# EAGLE design mcu_v2 (EAGLE 6.5.0)
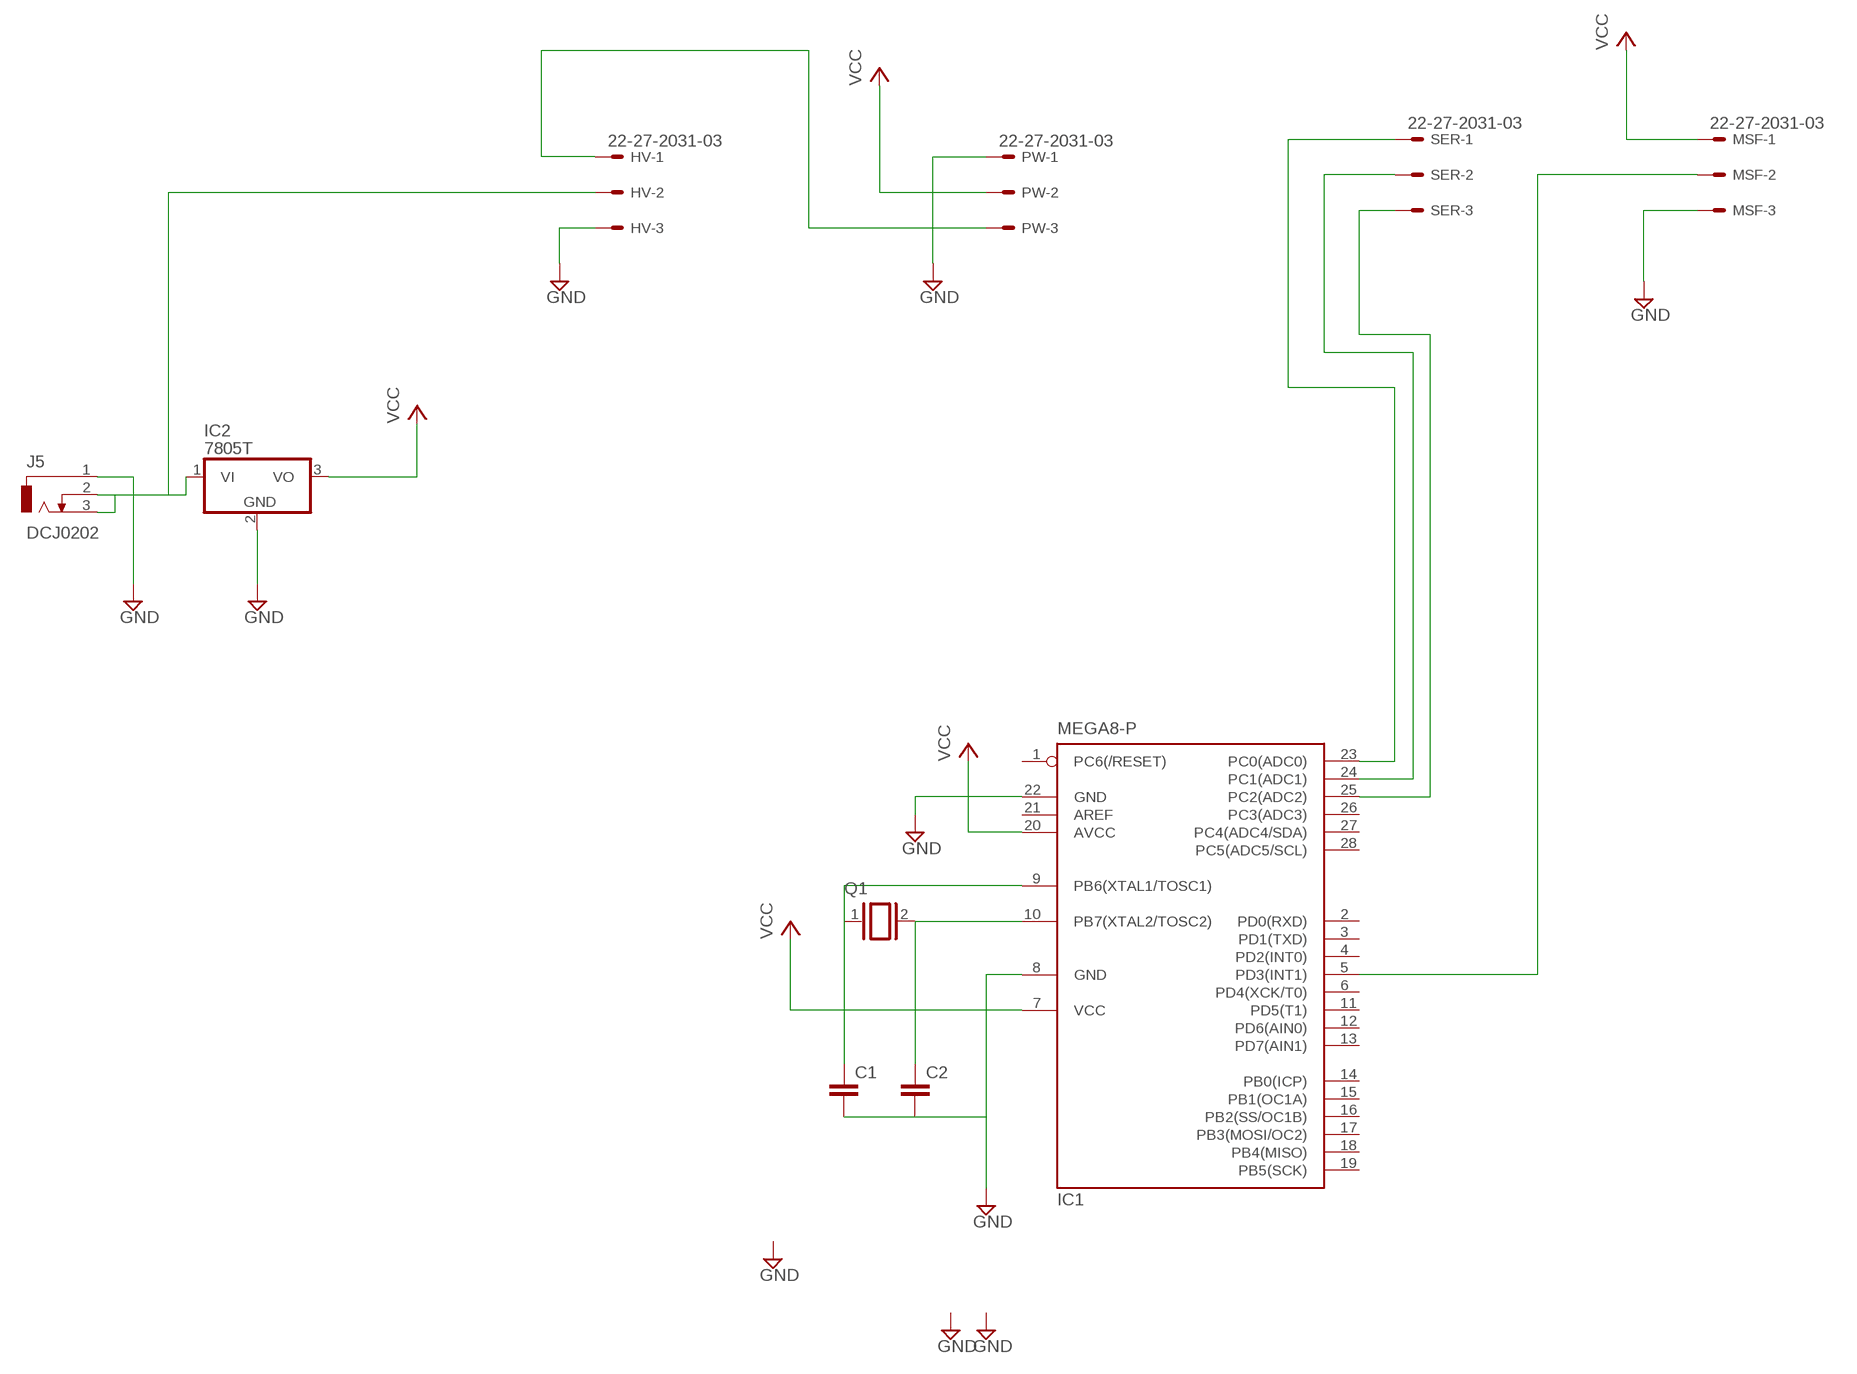
[diagram p0: schematic, sheet 1]

## Parts
C1  C2,5-3  [C2.5-3]
C2  C2,5-3  [C2.5-3]
HV  22-27-2031-03  [6410-03]
IC1  MEGA8-P  [DIL28-3]
IC2  7805T  [TO220H]
J5  DCJ0202  [DCJ0202]
MSF  22-27-2031-03  [6410-03]
PW  22-27-2031-03  [6410-03]
Q1  XTAL/S  [QS]
SER  22-27-2031-03  [6410-03]

## Nets
GND: C1.2 C2.2 HV.3 IC1.8(GND) IC1.22(GND) IC2.2(GND) J5.1 MSF.3 PW.1
N$1: HV.2 IC2.1(VI) J5.2 J5.3
N$2: HV.1 PW.3
N$3: C2.1 IC1.10(PB7(XTAL2/TOSC2)) Q1.2
N$4: C1.1 IC1.9(PB6(XTAL1/TOSC1)) Q1.1
N$6: IC1.5(PD3(INT1)) MSF.2
N$7: IC1.23(PC0(ADC0)) SER.1
N$8: IC1.24(PC1(ADC1)) SER.2
N$9: IC1.25(PC2(ADC2)) SER.3
VCC: IC1.7(VCC) IC1.20(AVCC) IC2.3(VO) MSF.1 PW.2
Unconnected: IC1.1(PC6(/RESET)) IC1.2(PD0(RXD)) IC1.3(PD1(TXD)) IC1.4(PD2(INT0)) IC1.6(PD4(XCK/T0)) IC1.11(PD5(T1)) IC1.12(PD6(AIN0)) IC1.13(PD7(AIN1)) IC1.14(PB0(ICP)) IC1.15(PB1(OC1A)) IC1.16(PB2(SS/OC1B)) IC1.17(PB3(MOSI/OC2)) IC1.18(PB4(MISO)) IC1.19(PB5(SCK)) IC1.21(AREF) IC1.26(PC3(ADC3)) IC1.27(PC4(ADC4/SDA)) IC1.28(PC5(ADC5/SCL))

## Library data of the parts
C1 C2 = capacitor-wima:C: CAPACITOR naming: grid - package width
HV MSF PW SER = con-molex:22-?-03: CONNECTOR wire to board 2.54 mm (.1 inch) pitch header; OC_FARNELL: unknown; OC_NEWARK: unknown
IC1 = atmel:MEGA8-P: MICROCONTROLLER 8 Kbytes FLASH, 1 kbytes SRAM, 512 bytes EEPROM, USART, 4-channel 10 bit ADC, 2-channel 8 bit ADC Pin compatible with Atmega48, ATMega88, ATMega168 Source: avr.lbr; OC_FARNELL: unknown; OC_NEWARK: unknown
IC2 = linear:78*: Positive VOLTAGE REGULATOR Source: http://cache.national.com/ds/LM/LM78L05.pdf http://www.fairchildsemi.com/ds/LM/LM7805.pdf
J5 = con-jack:DCJ0202: DC POWER JACK Source: DCJ0202.pdf; OC_FARNELL: unknown; OC_NEWARK: unknown
Q1 = special:XTAL/S: CRYSTAL

## Board
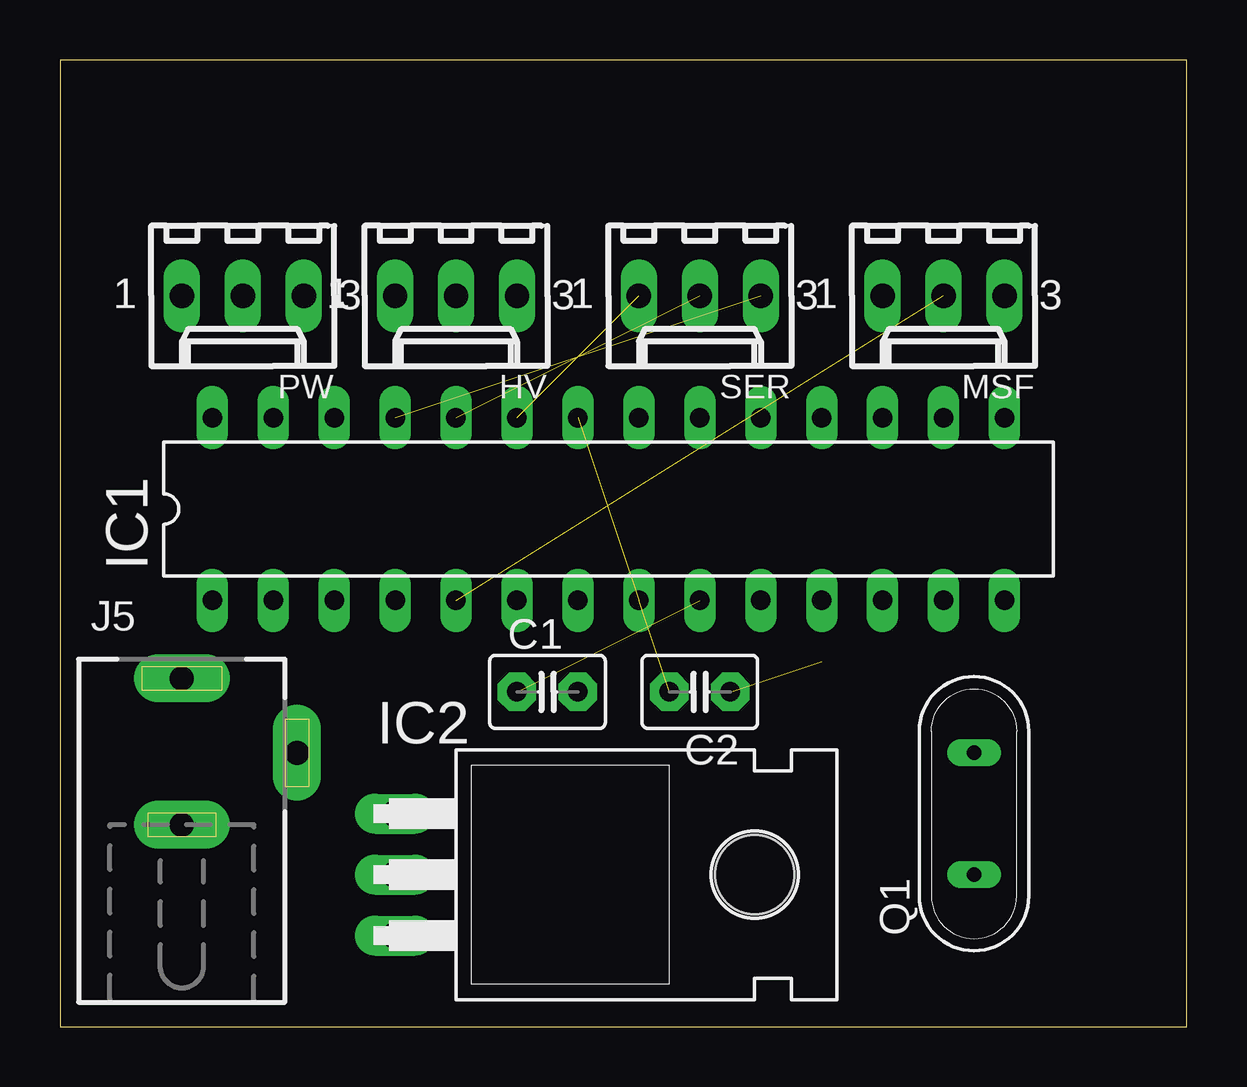
[diagram p1: board, top side]
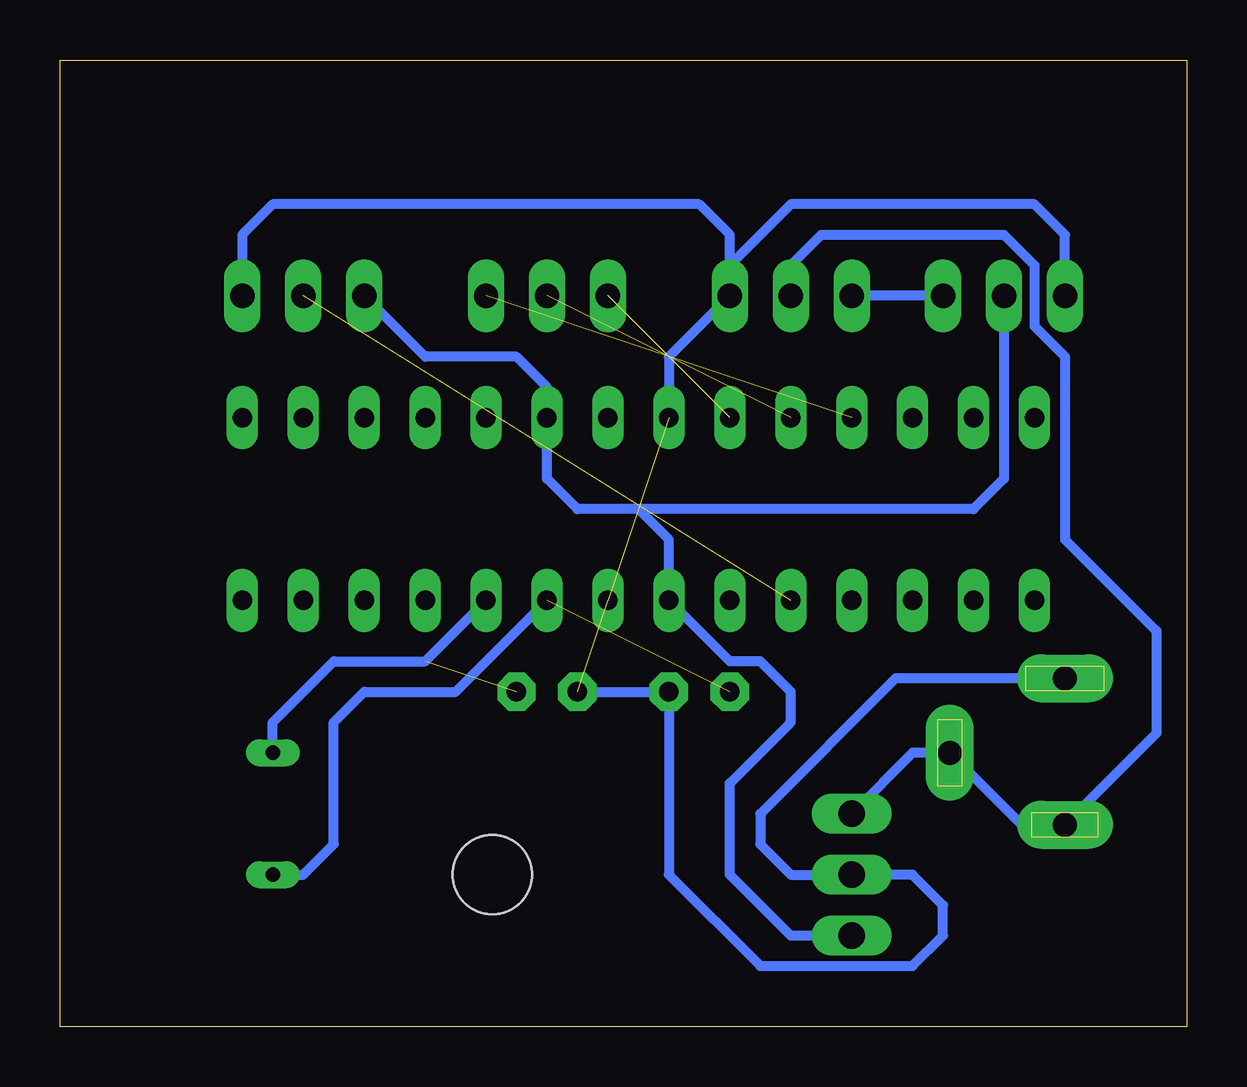
[diagram p2: board, bottom side, seen from below]

Size 46.97 x 40.31 mm. Coordinates in mm from the lower left corner, seen from the top.
Outline: 0,0 46.97,0 46.97,40.31 0,40.31 0,0
Copper layers (1*16): Top 0.035mm / dielectric 1.5mm / Bottom 0.035mm
Design rules "default": minimum track width 10mil, minimum drill 24mil, track to track 8mil, track to pad 8mil, pad to pad 8mil, via to via 8mil, smd to smd 8mil, copper to edge 40mil, drill to drill 8mil, minimum pad ring 10mil, minimum via ring 8mil, stop-mask expansion 4mil, vias tented up to drill 0mil, thermal gap 10mil

### Footprints (pad centres in the part's own frame; a part is rotated, then mirrored left to right if it is on the bottom)
C2.5-3 = drill 0.813 pad 1.6 octagon: 1 -1.27,0; 2 1.27,0
6410-03 = drill 1.016 long: 1 2.54,0; 2 0,0; 3 -2.54,0
DIL28-3 = drill 0.813 long: 1 -16.51,-3.81; 2 -13.97,-3.81; 3 -11.43,-3.81; 4 -8.89,-3.81; 5 -6.35,-3.81; 6 -3.81,-3.81; 7 -1.27,-3.81; 8 1.27,-3.81; 9 3.81,-3.81; 10 6.35,-3.81; 11 8.89,-3.81; 12 11.43,-3.81; 13 13.97,-3.81; 14 16.51,-3.81; 15 16.51,3.81; 16 13.97,3.81; 17 11.43,3.81; 18 8.89,3.81; 19 6.35,3.81; 20 3.81,3.81; 21 1.27,3.81; 22 -1.27,3.81; 23 -3.81,3.81; 24 -6.35,3.81; 25 -8.89,3.81; 26 -11.43,3.81; 27 -13.97,3.81; 28 -16.51,3.81
TO220H = drill 1.118 long: 1 -2.54,-10.16; 2 0,-10.16; 3 2.54,-10.16 | hole 3.302: 0,4.826
DCJ0202 = drill 1 pad 2 long: 1 0,3.1; 2 4.8,0; 3 0,-3
QS = drill 0.61 long: 1 -2.54,0; 2 2.54,0

### Placement (x,y rotation side)
C1  20.32,13.97 0 top
C2  26.67,13.97 180 top
HV  16.51,30.48 180 top
IC1  22.86,21.59 0 top
IC2  24.13,6.35 270 top
J5  5.08,11.43 0 top
MSF  36.83,30.48 180 top
PW  7.62,30.48 180 top
Q1  38.1,8.89 90 top
SER  26.67,30.48 180 top

### Tracks (layer width: path | path; a pad name or v marks a point on that pad's centre or on a via)
GND  (2 unrouted)
  Bottom 0.406: J5.1 12.14,14.53 17.78,8.89 17.78,7.62 16.51,6.35 IC2.2 11.43,6.35 10.16,5.08 10.16,3.81 11.43,2.54 17.78,2.54 21.59,6.35 C1.2 C2.2 | PW.1 5.08,33.02 6.35,34.29 16.51,34.29 19.05,31.75 HV.3 | HV.3 19.05,33.02 20.32,34.29 38.1,34.29 39.37,33.02 MSF.3 | HV.3 21.59,27.94 IC1.22
N$1
  Bottom 0.406: IC2.1 11.43,11.43 J5.2 6.88,8.43 J5.3 1.27,12.24 1.27,16.51 5.08,20.32 5.08,27.94 6.35,29.21 6.35,31.75 7.62,33.02 15.24,33.02 16.51,31.75 HV.2
N$2
  Bottom 0.406: PW.3 HV.1
N$3  (1 unrouted)
  Bottom 0.406: Q1.2 38.1,12.7 35.56,15.24 31.75,15.24 IC1.10
N$4  (1 unrouted)
  Bottom 0.406: Q1.1 36.83,6.35 35.56,7.62 35.56,12.7 34.29,13.97 30.48,13.97 IC1.9
N$6  (1 unrouted)
N$7  (1 unrouted)
N$8  (1 unrouted)
N$9  (1 unrouted)
VCC
  Bottom 0.406: IC2.3 16.51,3.81 19.05,6.35 19.05,10.16 16.51,12.7 16.51,13.97 17.78,15.24 19.05,15.24 IC1.7 21.59,20.32 22.86,21.59 | 22.86,21.59 25.4,21.59 26.67,22.86 IC1.20 26.67,26.67 27.94,27.94 31.75,27.94 MSF.1 | PW.2 7.62,22.86 8.89,21.59 22.86,21.59